# EAGLE design AVerCADE (EAGLE 7.2.0)
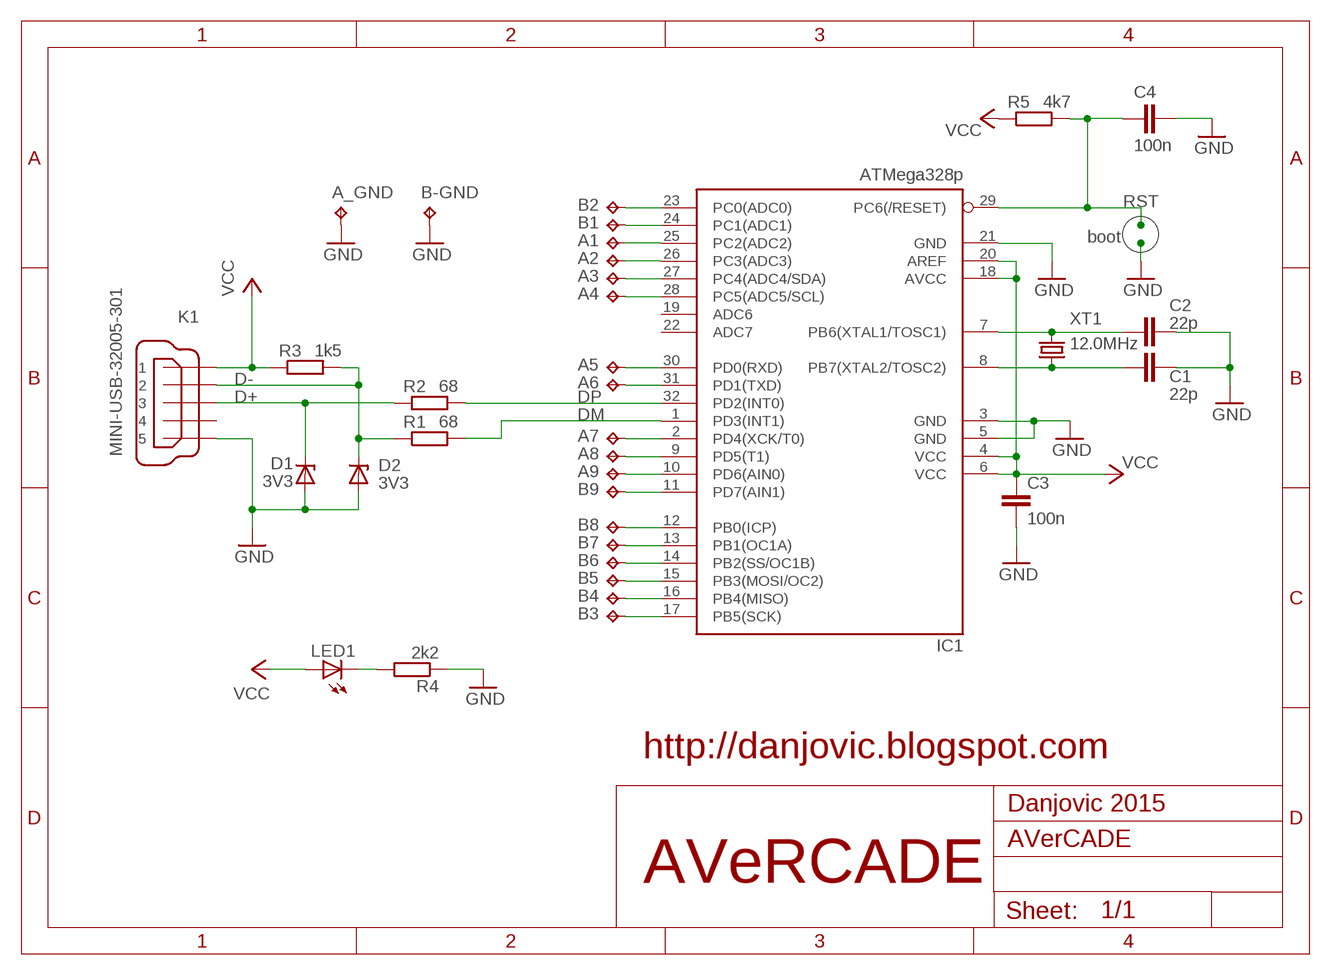
[diagram p0: schematic, sheet 1]

## Parts
A1  TPPAD1-13  [P1-13]
A2  TPPAD1-13  [P1-13]
A3  TPPAD1-13  [P1-13]
A4  TPPAD1-13  [P1-13]
A5  TPPAD1-13  [P1-13]
A6  TPPAD1-13  [P1-13]
A7  TPPAD1-13  [P1-13]
A8  TPPAD1-13  [P1-13]
A9  TPPAD1-13  [P1-13]
A_GND  TPPAD1-13  [P1-13]
B1  TPPAD1-13  [P1-13]
B2  TPPAD1-13  [P1-13]
B3  TPPAD1-13  [P1-13]
B4  TPPAD1-13  [P1-13]
B5  TPPAD1-13  [P1-13]
B6  TPPAD1-13  [P1-13]
B7  TPPAD1-13  [P1-13]
B8  TPPAD1-13  [P1-13]
B9  TPPAD1-13  [P1-13]
B-GND  TPPAD1-13  [P1-13]
C1  22p  C-EUC0805  [C0805]
C2  22p  C-EUC0805  [C0805]
C3  100n  C-EUC1206  [C1206]
C4  100n  C-EUC1206  [C1206]
D1  3V3  ZENER-DIODESOD80C  [SOD80C]
D2  3V3  ZENER-DIODESOD80C  [SOD80C]
IC1  ATMega328p  MEGA8-AI  [TQFP32-08]
K1  MINI-USB-32005-301  [32005-301]
LED1  LEDSML1206  [SML1206]
R1  68  R-EU_M1206  [M1206]
R2  68  R-EU_M1206  [M1206]
R3  1k5  R-EU_M1206  [M1206]
R4  2k2  R-EU_M1206  [M1206]
R5  4k7  R-EU_M1206  [M1206]
XT1  12.0MHz  CRYSTALHC49UP  [HC49UP]

## Nets
AN2: A1.TP IC1.25(PC2(ADC2))
AN3: A2.TP IC1.26(PC3(ADC3))
D+: D1.C K1.3 R2.1
D-: D2.C K1.2 R1.1 R3.2
DM: IC1.1(PD3(INT1)) R1.2
DP: IC1.32(PD2(INT0)) R2.2
GND: A_GND.TP B-GND.TP C1.2 C2.2 C3.2 C4.2 D1.A D2.A IC1.3(GND) IC1.5(GND) IC1.21(GND) K1.5 R4.1
N$1: A5.TP IC1.30(PD0(RXD))
N$2: A7.TP IC1.2(PD4(XCK/T0))
N$3: B1.TP IC1.24(PC1(ADC1))
N$4: B2.TP IC1.23(PC0(ADC0))
N$5: A3.TP IC1.27(PC4(ADC4/SDA))
N$6: A4.TP IC1.28(PC5(ADC5/SCL))
N$7: A6.TP IC1.31(PD1(TXD))
N$8: A8.TP IC1.9(PD5(T1))
N$9: A9.TP IC1.10(PD6(AIN0))
N$10: B9.TP IC1.11(PD7(AIN1))
N$11: LED1.C R4.2
N$12: B8.TP IC1.12(PB0(ICP))
N$13: B6.TP IC1.14(PB2(SS/OC1B))
N$14: B7.TP IC1.13(PB1(OC1A))
N$15: B3.TP IC1.17(PB5(SCK))
N$16: B4.TP IC1.16(PB4(MISO))
N$17: B5.TP IC1.15(PB3(MOSI/OC2))
RST: C4.1 IC1.29(PC6(/RESET)) R5.2
VCC: C3.1 IC1.4(VCC) IC1.6(VCC) IC1.18(AVCC) IC1.20(AREF) K1.1 LED1.A R3.1 R5.1
X1: C2.1 IC1.7(PB6(XTAL1/TOSC1)) XT1.2
X2: C1.1 IC1.8(PB7(XTAL2/TOSC2)) XT1.1
Unconnected: IC1.19(ADC6) IC1.22(ADC7) K1.4

## Notes on the sheet
- boot
- http://danjovic.blogspot.com
- Danjovic 2015
- AVeRCADE

## Library data of the parts
A1-A9 A_GND B1-B9 B-GND = testpad:TP: Test pad
C1-C4 = rcl:C-EU: CAPACITOR, European symbol
D1 D2 = diode:ZENER-DIODE: Z-Diode
IC1 = atmel:MEGA8: MICROCONTROLLER 8 Kbytes FLASH, 1 kbytes SRAM, 512 bytes EEPROM, USART, 6-channel 10 bit ADC, 2-channel 8 bit ADC Pin compatible with Atmega48, ATMega88, ATMega168 Source: avr.lbr; MPN: ATMEGA8-16AU; OC_FARNELL: 9171371; OC_NEWARK: 73M8863
K1 = con-cypressindustries:MINI-USB-: MINI USB-B Conector Source: www.cypressindustries.com; OC_FARNELL: unknown; OC_NEWARK: unknown
LED1 = led:LED: LED OSRAM: - CHIPLED LG R971, LG N971, LY N971, LG Q971, LY Q971, LO R971, LY R971 LH N974, LH R974 LS Q976, LO Q976, LY Q976 LO Q996 - Hyper CHIPLED LW Q18S LB Q993, LB Q99A, LB R99A - SideLED LS A670, LO A670, LY A670, LG A670, LP A670 LB A673, LV A673, LT A673, LW A673 LH A674 LY A675 LS A676, LA A676, LO A676, LY A676, LW A676 LS A679, LY A679, LG A679 - Hyper Micro SIDELED® LS Y876, LA Y876, LO Y876, LY Y876 LT Y87S - SmartLED LW L88C, LW L88S LB L89C, LB L89S, LG L890 LS L89K, LO L89K, LY L89K LS L896, LA L896, LO L896, LY L896 - TOPLED LS T670, LO T670, LY T670, LG T670, LP T670 LSG T670, LSP T670, LSY T670, LOP T670, LYG T670 LG T671, LOG T671, LSG T671 LB T673, LV T673, LT T673, LW T673 LH T674 LS T676, LA T676, LO T676, LY T676, LB T676, LH T676, LSB T676, LW T676 LB T67C, LV T67C, LT T67C, LS T67K, LO T67K, LY T67K, LW E67C LS E67B, LA E67B, LO E67B, LY E67B, LB E67C, LV E67C, LT E67C LW T67C LS T679, LY T679, LG T679 LS T770, LO T770, LY T770, LG T770, LP T770 LB T773, LV T773, LT T773, LW T773 LH T774 LS E675, LA E675, LY E675, LS T675 LS T776, LA T776, LO T776, LY T776, LB T776 LHGB T686 LT T68C, LB T68C - Hyper Mini TOPLED® LB M676 - Mini TOPLED Santana® LG M470 LS M47K, LO M47K, LY M47K Source: http://www.osram.convergy.de LUXEON: - LUMILED® LXK2-PW12-R00, LXK2-PW12-S00, LXK2-PW14-U00, LXK2-PW14-V00 LXK2-PM12-R00, LXK2-PM12-S00, LXK2-PM14-U00 LXK2-PE12-Q00, LXK2-PE12-R00, LXK2-PE12-S00, LXK2-PE14-T00, LXK2-PE14-U00 LXK2-PB12-K00, LXK2-PB12-L00, LXK2-PB12-M00, LXK2-PB14-N00, LXK2-PB14-P00, LXK2-PB14-Q00 LXK2-PR12-L00, LXK2-PR12-M00, LXK2-PR14-Q00, LXK2-PR14-R00 LXK2-PD12-Q00, LXK2-PD12-R00, LXK2-PD12-S00 LXK2-PH12-R00, LXK2-PH12-S00 LXK2-PL12-P00, LXK2-PL12-Q00, LXK2-PL12-R00 Source: www.luxeon.com KINGBRIGHT: KA-3528ASYC Source: www.kingbright.com
R1-R5 = rcl:R-EU_: RESISTOR, European symbol
XT1 = crystal:CRYSTAL: CRYSTAL; OC_FARNELL: unknown; OC_NEWARK: unknown

## Board
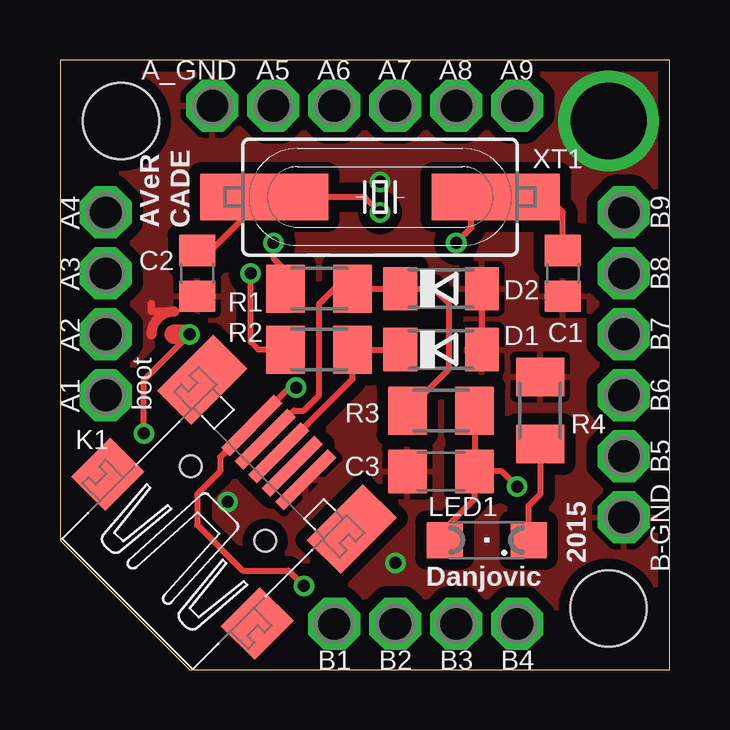
[diagram p1: board, top side]
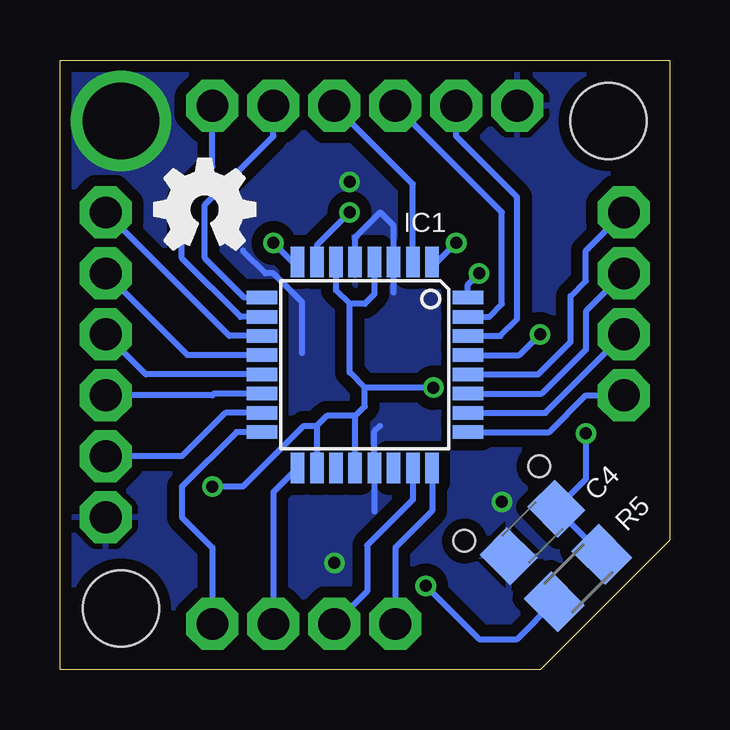
[diagram p2: board, bottom side, seen from below]

Size 25.4 x 25.4 mm. Coordinates in mm from the lower left corner, seen from the top.
Outline: 0,5.4 5.4,0 25.4,0 25.4,25.4 0,25.4 0,5.4
Copper layers (1*16): Top 0.0356mm / dielectric 1.5011mm / Bottom 0.0356mm
Design rules "LaenPCBOrder *": minimum track width 6mil, minimum drill 13mil, track to track 6mil, track to pad 6mil, pad to pad 6mil, via to via 6mil, smd to smd 6mil, copper to edge 15mil, drill to drill 6mil, minimum pad ring 7mil, minimum via ring 7mil, stop-mask expansion 3mil, vias tented up to drill 0mil, thermal gap 10mil
Holes 3.17 mm at 2.54,22.86 22.86,2.54

### Footprints (pad centres in the part's own frame; a part is rotated, then mirrored left to right if it is on the bottom)
P1-13 = drill 1.321 pad 2.159 octagon: TP 0,0
C0805 = smd 1.3 x 1.5: 1 -0.95,0; 2 0.95,0
C1206 = smd 1.6 x 1.8: 1 -1.4,0; 2 1.4,0
SOD80C = smd 1.4 x 1.8: A 1.7,0; C -1.7,0
TQFP32-08 = smd 1.27 x 0.559: 1 -4.293,2.8; 2 -4.293,2; 3 -4.293,1.2; 4 -4.293,0.4; 5 -4.293,-0.4; 6 -4.293,-1.2; 7 -4.293,-2; 8 -4.293,-2.8; 17 4.293,-2.8; 18 4.293,-2; 19 4.293,-1.2; 20 4.293,-0.4; 21 4.293,0.4; 22 4.293,1.2; 23 4.293,2; 24 4.293,2.8 | smd 0.559 x 1.27: 9 -2.8,-4.293; 10 -2,-4.293; 11 -1.2,-4.293; 12 -0.4,-4.293; 13 0.4,-4.293; 14 1.2,-4.293; 15 2,-4.293; 16 2.8,-4.293; 25 2.8,4.293; 26 2,4.293; 27 1.2,4.293; 28 0.4,4.293; 29 -0.4,4.293; 30 -1.2,4.293; 31 -2,4.293; 32 -2.8,4.293
32005-301 = smd 3.1 x 0.5: 1 3,1.6; 2 3,0.8; 3 3,0; 4 3,-0.8; 5 3,-1.6 | smd 2.297 x 2: M1 -2.667,-4.399; M2 -2.667,4.399 | smd 3.3 x 2: M3 2.9,4.399; M4 2.9,-4.399 | hole 0.9: 0,2.2; 0,-2.2
SML1206 = smd 1.5 x 1.5: A 1.75,0; C -1.75,0
M1206 = smd 1.6 x 2: 1 -1.4,0; 2 1.4,0
HC49UP = smd 5.334 x 1.93: 1 -4.826,0; 2 4.826,0

### Placement (x,y rotation side)
A1  1.91,11.43 0 top
A2  1.91,13.97 0 top
A3  1.91,16.51 0 top
A4  1.91,19.05 0 top
A5  8.89,23.5 0 top
A6  11.43,23.5 0 top
A7  13.97,23.5 0 top
A8  16.51,23.5 0 top
A9  19.05,23.5 0 top
A_GND  6.35,23.5 0 top
B1  11.43,1.91 0 top
B2  13.97,1.91 0 top
B3  16.51,1.91 0 top
B4  19.05,1.91 0 top
B5  23.5,8.89 270 top
B6  23.5,11.43 270 top
B7  23.5,13.97 270 top
B8  23.5,16.51 270 top
B9  23.5,19.05 270 top
B-GND  23.5,6.35 270 top
C1  20.95,16.51 270 top
C2  5.71,16.51 270 top
C3  15.88,8.26 180 top
C4  5.71,5.71 225 bottom
D1  15.88,13.34 0 top
D2  15.88,15.88 0 top
IC1  12.7,12.7 270 bottom
K1  6.99,6.92 45 top
LED1  17.78,5.4 180 top
R1  10.79,15.88 180 top
R2  10.79,13.34 180 top
R3  15.88,10.79 180 top
R4  20,10.79 270 top
R5  3.81,3.81 45 bottom
XT1  13.34,19.68 180 top

### Tracks (layer width: path | path; a pad name or v marks a point on that pad's centre or on a via)
AN2
  Bottom 0.254: IC1.25 5.02,9.9 3.49,11.43 A1.TP
AN3
  Bottom 0.254: IC1.26 5.17,10.7 A2.TP
D+
  Top 0.254: D1.C R2.1 12.2,12.12 K1.3
D-
  Top 0.254: R3.2 16.19,12.51 16.19,15.24 15.56,15.88 D2.C R1.1 11.43,15.88 10.79,15.24 10.79,11.43 10.16,10.79 9.74,10.79 K1.2
DM  (via drill 0.5)
  Top 0.254: R1.2 9.39,16.64 8.89,17.14 v8.89,17.78
  Bottom 0.254: v8.89,17.78 9.68,16.99 IC1.1
DP  (via drill 0.5)
  Top 0.254: R2.2 8.26,13.34 7.94,13.65 v7.94,16.51
  Bottom 0.254: IC1.32 8.41,16.04 v7.94,16.51
GND  (via drill 0.5, 3.17)
  Top 0.254: D2.A D1.A
  Top 0.305: 4.76,14.92 3.81,14.92 3.81,15.24
  Top 0.406: 4.76,14.92 arc90 3.81,13.97
  Bottom 0.254: 12.3,6.58 IC1.21 12.3,9.93 12.06,10.16 | IC1.5 13.1,18.02 12.06,19.05 11.5,18.48 IC1.3 11.5,15.72 | 15.31,13.18 15.31,15.31 16.51,16.51 16.83,16.51 17.78,17.46
  other vias: 13.97,4.45 22.86,22.86 13.34,20.32 6.99,6.99
  pour Top (isolate 0.483): 0,25.4 0,0 25.4,0 25.4,25.4
  pour Bottom (isolate 0.483): 25.4,0 25.4,25.4 0,25.4 0,0
N$1
  Bottom 0.254: IC1.30 7.05,13.9 6.35,14.61 6.35,19.68 8.89,22.23 A5.TP
N$2
  Bottom 0.254: IC1.2 10.7,20.23 A7.TP
N$3
  Bottom 0.254: IC1.24 9.9,6.61 11.43,5.08 B1.TP
N$4
  Bottom 0.254: IC1.23 10.7,7.08 12.61,5.17 12.61,3.27 B2.TP
N$5
  Bottom 0.254: A3.TP 3.49,14.92 3.49,13.34 5.33,11.5 IC1.27
N$6
  Bottom 0.254: IC1.28 5.48,12.3 4.13,13.65 4.13,15.56 3.49,16.19 3.49,17.46 A4.TP
N$7
  Bottom 0.254: IC1.31 7.53,14.7 6.99,15.24 6.99,19.05 A6.TP
N$8
  Bottom 0.254: A8.TP 16.51,22.23 19.37,19.37 19.37,17.14 17.72,15.5 IC1.9
N$9
  Bottom 0.254: IC1.10 17.88,14.7 20.32,17.14 20.32,19.68 19.05,20.95 A9.TP
N$10
  Bottom 0.254: IC1.11 18.34,13.9 B9.TP
N$11
  Top 0.254: R4.2 20,7.3 19.53,6.83 LED1.C
N$12
  Bottom 0.254: IC1.12 20.09,13.1 B8.TP
N$13
  Bottom 0.254: IC1.14 18.98,11.5 19.05,11.43 B6.TP
N$14
  Bottom 0.254: IC1.13 21.82,12.3 B7.TP
N$15
  Bottom 0.254: IC1.17 16.51,7.4 B3.TP
N$16
  Bottom 0.254: IC1.16 18.04,9.9 20.32,7.62 20.32,6.35 19.05,5.08 B4.TP
N$17
  Bottom 0.254: IC1.15 18.51,10.7 20.32,8.89 B5.TP
RST  (via drill 0.5)
  Top 0.254: v3.49,9.84 3.49,12.06 v5.4,13.97
  Top 0.813: v5.4,13.97 4.76,13.97
  Bottom 0.254: IC1.29 6.27,13.1 v5.4,13.97 | v3.49,9.84 3.49,7.94 C4.1 R5.2
VCC  (via drill 0.5)
  Top 0.254: R3.1 C3.1 | v9.84,11.75 9.56,11.75 K1.1 6.67,8.85 6.67,8.26 5.71,7.3 5.71,6.03 7.62,4.13 9.53,4.13 v10.16,3.49 | C3.1 17.65,7.88 17.65,7.62 17.78,7.62 17.78,8.26 | 16.83,7.81 C3.1 | LED1.A 16.03,5.87 17.27,7.12 C3.1 | v19.05,7.62 18.41,8.26 17.78,8.26 | 17.78,8.26 17.46,8.26
  Bottom 0.254: IC1.6 13.9,15.8 13.34,15.24 | IC1.4 12.3,15.64 12.7,15.24 13.34,15.24 | v9.84,11.75 12.7,11.75 | 14.7,10.16 IC1.18 | 14.7,10.16 15.24,10.16 17.78,7.62 v19.05,7.62 | 14.7,10.16 14.29,10.57 13.1,10.57 | IC1.20 13.1,10.57 | 13.1,10.57 12.7,10.97 12.7,11.75 | 12.7,11.75 13.34,12.38 13.34,15.24 | R5.1 6.35,1.27 7.94,1.27 v10.16,3.49
X1  (via drill 0.5)
  Top 0.254: v13.34,19.05 12.7,19.68 XT1.2 6.28,17.46 C2.1
  Bottom 0.254: v13.34,19.05 14.7,17.68 IC1.7
X2  (via drill 0.5)
  Top 0.254: v16.51,17.78 17.14,18.41 17.14,19.3 17.78,19.3 XT1.1 20.32,19.68 20.95,19.05 C1.1
  Bottom 0.254: IC1.8 15.72,16.99 v16.51,17.78

### Text on the board
tPlace: AVeR | CADE | 2015 | Danjovic
tNames: boot